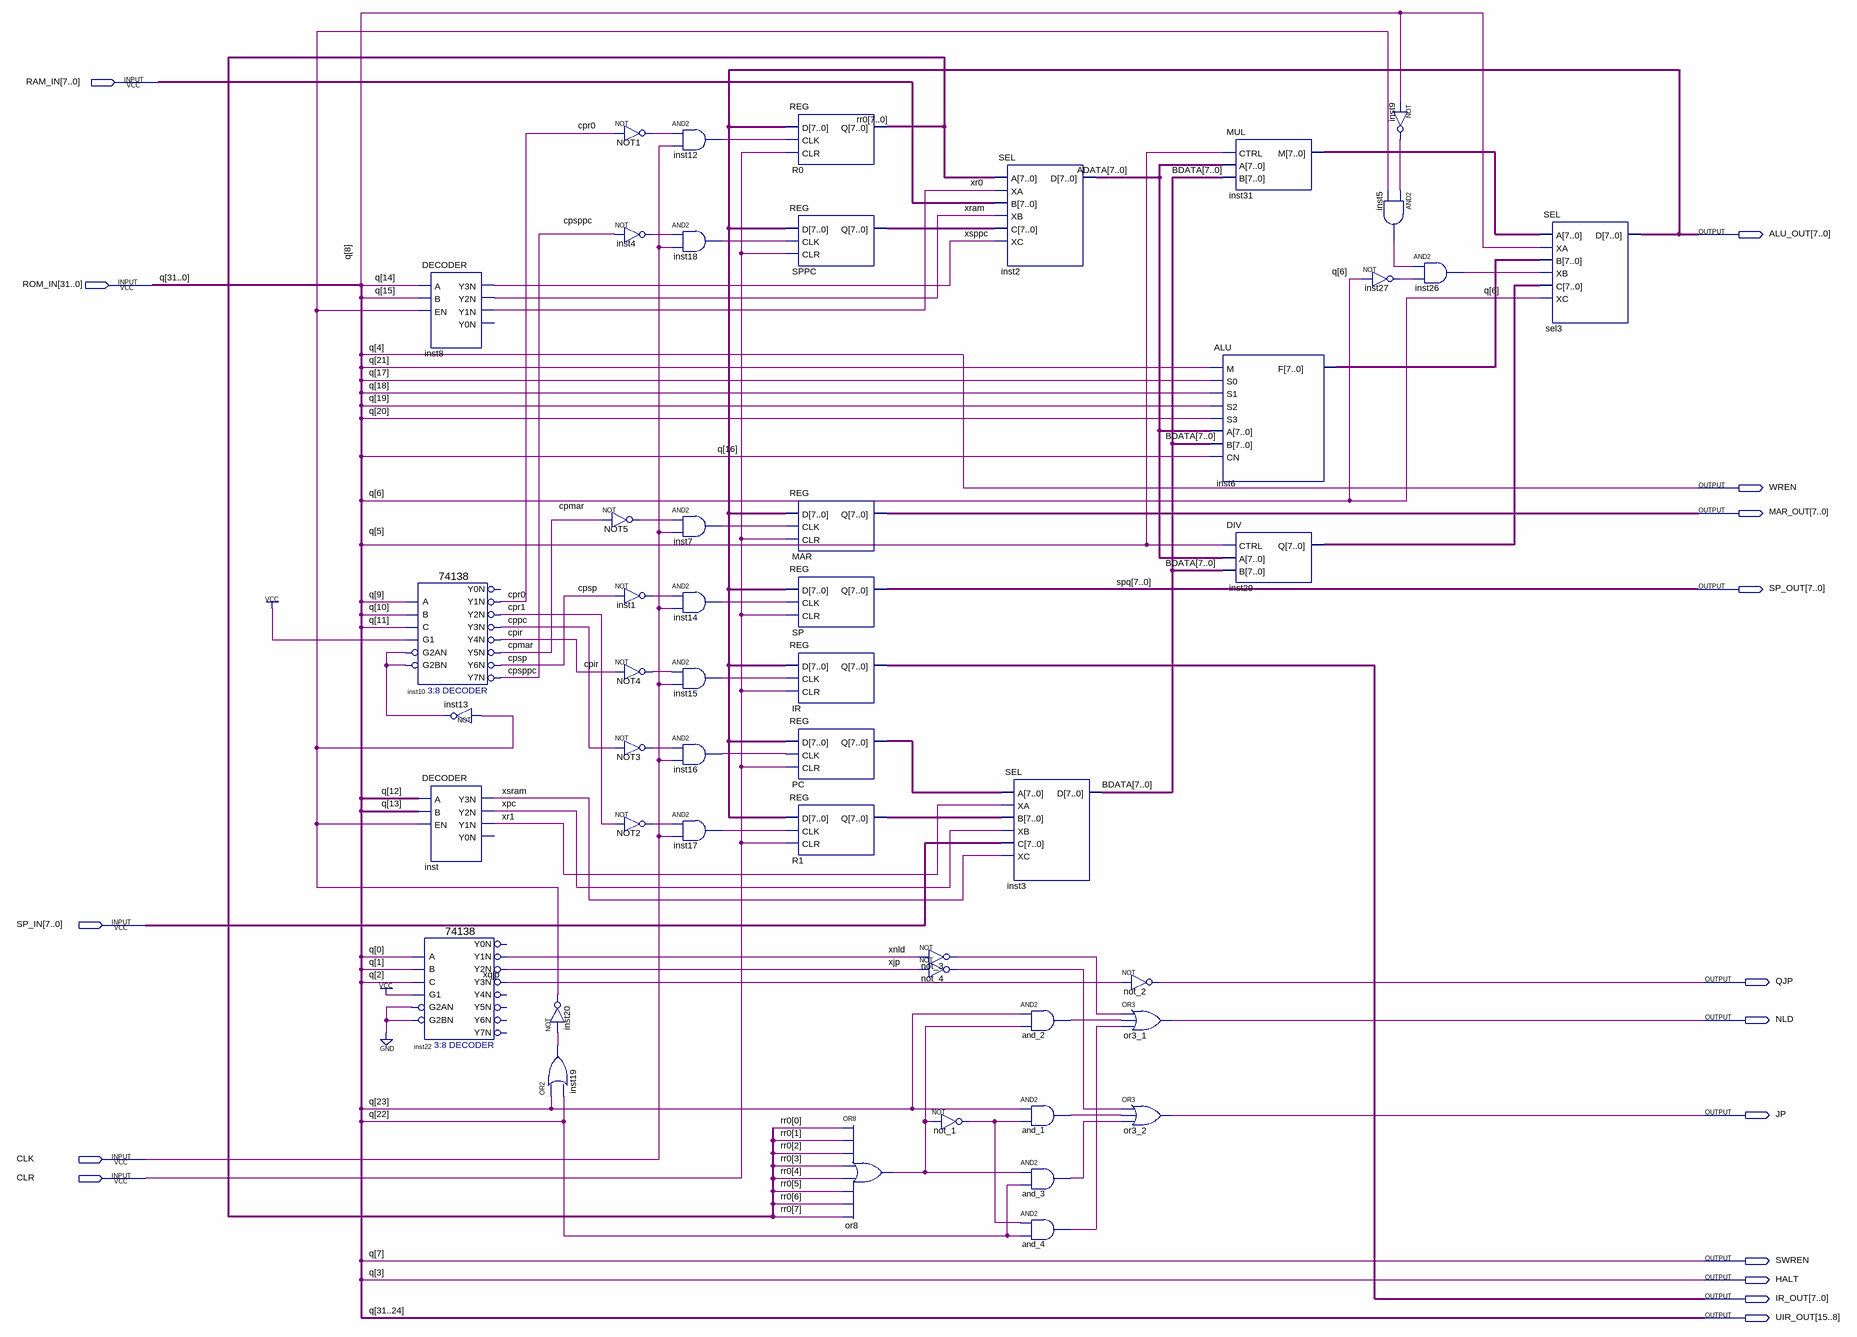
[diagram p0: schematic sheet]
// Quartus schematic MYCPU.bdf as structural Verilog: 49 symbols, 16 pins
module MYCPU (
  input  [7:0] RAM_IN,
  input  [31:0] ROM_IN,
  input  [7:0] SP_IN,
  input  CLK,
  input  CLR,
  output [7:0] ALU_OUT,
  output WREN,
  output [7:0] MAR_OUT,
  output [7:0] SP_OUT,
  output QJP,
  output NLD,
  output JP,
  output SWREN,
  output HALT,
  output [7:0] IR_OUT,
  output [15:8] UIR_OUT
);

  wire and_1_out, and_2_out, and_3_out, and_4_out, cpir, cpmar, cppc, cpr0, cpr1, cpsp, cpsppc, inst1_out,
       inst4_out, inst5_out, inst7_out, inst9_out, inst12_out, inst13_out, inst14_out, inst15_out,
       inst16_out, inst17_out, inst18_out, inst19_out, inst20_out, inst26_out, inst27_out, NOT1_out,
       NOT2_out, NOT3_out, NOT4_out, NOT5_out, not_1_out, not_3_out, not_4_out, or8_out, xjp, xnld, xpc,
       xqjp, xr0, xr1, xram, xsppc, xsram;
  wire [7:0] ADATA, BDATA, inst6_f, inst29_q, inst31_m, PC_q, R1_q, rr0, SPPC_q;

  DECODER inst8 (.A(ROM_IN[14]), .B(ROM_IN[15]), .EN(inst20_out), .Y3N(xsppc), .Y2N(xram), .Y1N(xr0));  // open: Y0N
  \74138  inst10 (
    .A(ROM_IN[9]), .B(ROM_IN[10]), .G1(1'b1), .C(ROM_IN[11]), .G2AN(inst13_out), .G2BN(inst13_out),
    .Y1N(cpr0), .Y2N(cpr1), .Y3N(cppc), .Y4N(cpir), .Y5N(cpmar), .Y6N(cpsp), .Y7N(cpsppc));  // open: Y0N
  DECODER inst (.A(ROM_IN[12]), .B(ROM_IN[13]), .EN(inst20_out), .Y3N(xsram), .Y2N(xpc), .Y1N(xr1));  // open: Y0N
  \74138  inst22 (
    .A(ROM_IN[0]), .B(ROM_IN[1]), .G1(1'b1), .C(ROM_IN[2]), .G2AN(1'b0), .G2BN(1'b0), .Y1N(xnld), .Y2N(xjp),
    .Y3N(xqjp));  // open: Y0N, Y4N, Y5N, Y6N, Y7N
  not inst13 (inst13_out, inst20_out);
  or inst19 (inst19_out, ROM_IN[23], ROM_IN[22]);
  not inst20 (inst20_out, inst19_out);
  not NOT1 (NOT1_out, cpr0);
  not inst4 (inst4_out, cpsppc);
  not NOT5 (NOT5_out, cpmar);
  not inst1 (inst1_out, cpsp);
  not NOT4 (NOT4_out, cpir);
  not NOT3 (NOT3_out, cppc);
  not NOT2 (NOT2_out, cpr1);
  and inst12 (inst12_out, NOT1_out, CLK);
  and inst18 (inst18_out, inst4_out, CLK);
  and inst7 (inst7_out, NOT5_out, CLK);
  and inst14 (inst14_out, inst1_out, CLK);
  and inst15 (inst15_out, NOT4_out, CLK);
  and inst16 (inst16_out, NOT3_out, CLK);
  and inst17 (inst17_out, NOT2_out, CLK);
  REG R0 (.D(ALU_OUT), .CLK(inst12_out), .CLR(CLR), .Q(rr0));
  REG SPPC (.D(ALU_OUT), .CLK(inst18_out), .CLR(CLR), .Q(SPPC_q));
  REG MAR (.D(ALU_OUT), .CLK(inst7_out), .CLR(CLR), .Q(MAR_OUT));
  REG SP (.D(ALU_OUT), .CLK(inst14_out), .CLR(CLR), .Q(SP_OUT));
  REG IR (.D(ALU_OUT), .CLK(inst15_out), .CLR(CLR), .Q(IR_OUT));
  REG PC (.D(ALU_OUT), .CLK(inst16_out), .CLR(CLR), .Q(PC_q));
  REG R1 (.D(ALU_OUT), .CLK(inst17_out), .CLR(CLR), .Q(R1_q));
  or or8 (or8_out, rr0[0], rr0[1], rr0[2], rr0[3], rr0[4], rr0[5], rr0[6], rr0[7]);
  not not_3 (not_3_out, xnld);
  not not_4 (not_4_out, xjp);
  not not_1 (not_1_out, or8_out);
  SEL inst2 (.A(rr0), .XA(xr0), .B(RAM_IN), .XB(xram), .C(SPPC_q), .XC(xsppc), .D(ADATA));
  SEL inst3 (.A(PC_q), .XA(xr1), .B(R1_q), .XB(xpc), .C(SP_IN), .XC(xsram), .D(BDATA));
  and and_2 (and_2_out, ROM_IN[23], or8_out);
  and and_1 (and_1_out, ROM_IN[23], not_1_out);
  and and_3 (and_3_out, or8_out, ROM_IN[22]);
  and and_4 (and_4_out, not_1_out, ROM_IN[22]);
  not not_2 (QJP, xqjp);
  or or3_1 (NLD, not_3_out, and_2_out, and_4_out);
  or or3_2 (JP, not_4_out, and_1_out, and_3_out);
  MUL inst31 (.CTRL(ROM_IN[5]), .A(ADATA), .B(BDATA), .M(inst31_m));
  ALU inst6 (
    .M(ROM_IN[21]), .S0(ROM_IN[17]), .S1(ROM_IN[18]), .S2(ROM_IN[19]), .S3(ROM_IN[20]), .A(ADATA), .B(BDATA),
    .CN(ROM_IN[16]), .F(inst6_f));
  DIV inst29 (.CTRL(ROM_IN[5]), .A(ADATA), .B(BDATA), .Q(inst29_q));
  not inst9 (inst9_out, ROM_IN[8]);
  and inst5 (inst5_out, inst9_out, inst20_out);
  not inst27 (inst27_out, ROM_IN[6]);
  and inst26 (inst26_out, inst5_out, inst27_out);
  SEL sel3 (.A(inst31_m), .XA(ROM_IN[8]), .B(inst6_f), .XB(inst26_out), .C(inst29_q), .XC(ROM_IN[6]), .D(ALU_OUT));

  assign HALT = ROM_IN[3];
  assign SWREN = ROM_IN[7];
  assign UIR_OUT = ROM_IN[31:24];
  assign WREN = ROM_IN[4];

  // Other names for the same wires on the sheet: q[31:0] = ROM_IN; spq[7:0] = SP_OUT
endmodule
